# EasyEDA Pro project jlcProject.epro, schematic Schematic6
Create Date: 2025-04-17; Page Name: P1; Project Name: 电综; Schematic Name: Schematic6; Update Date: 2025-04-17; Company: 嘉立创EDA; Page Size: A4; Version: V1.0
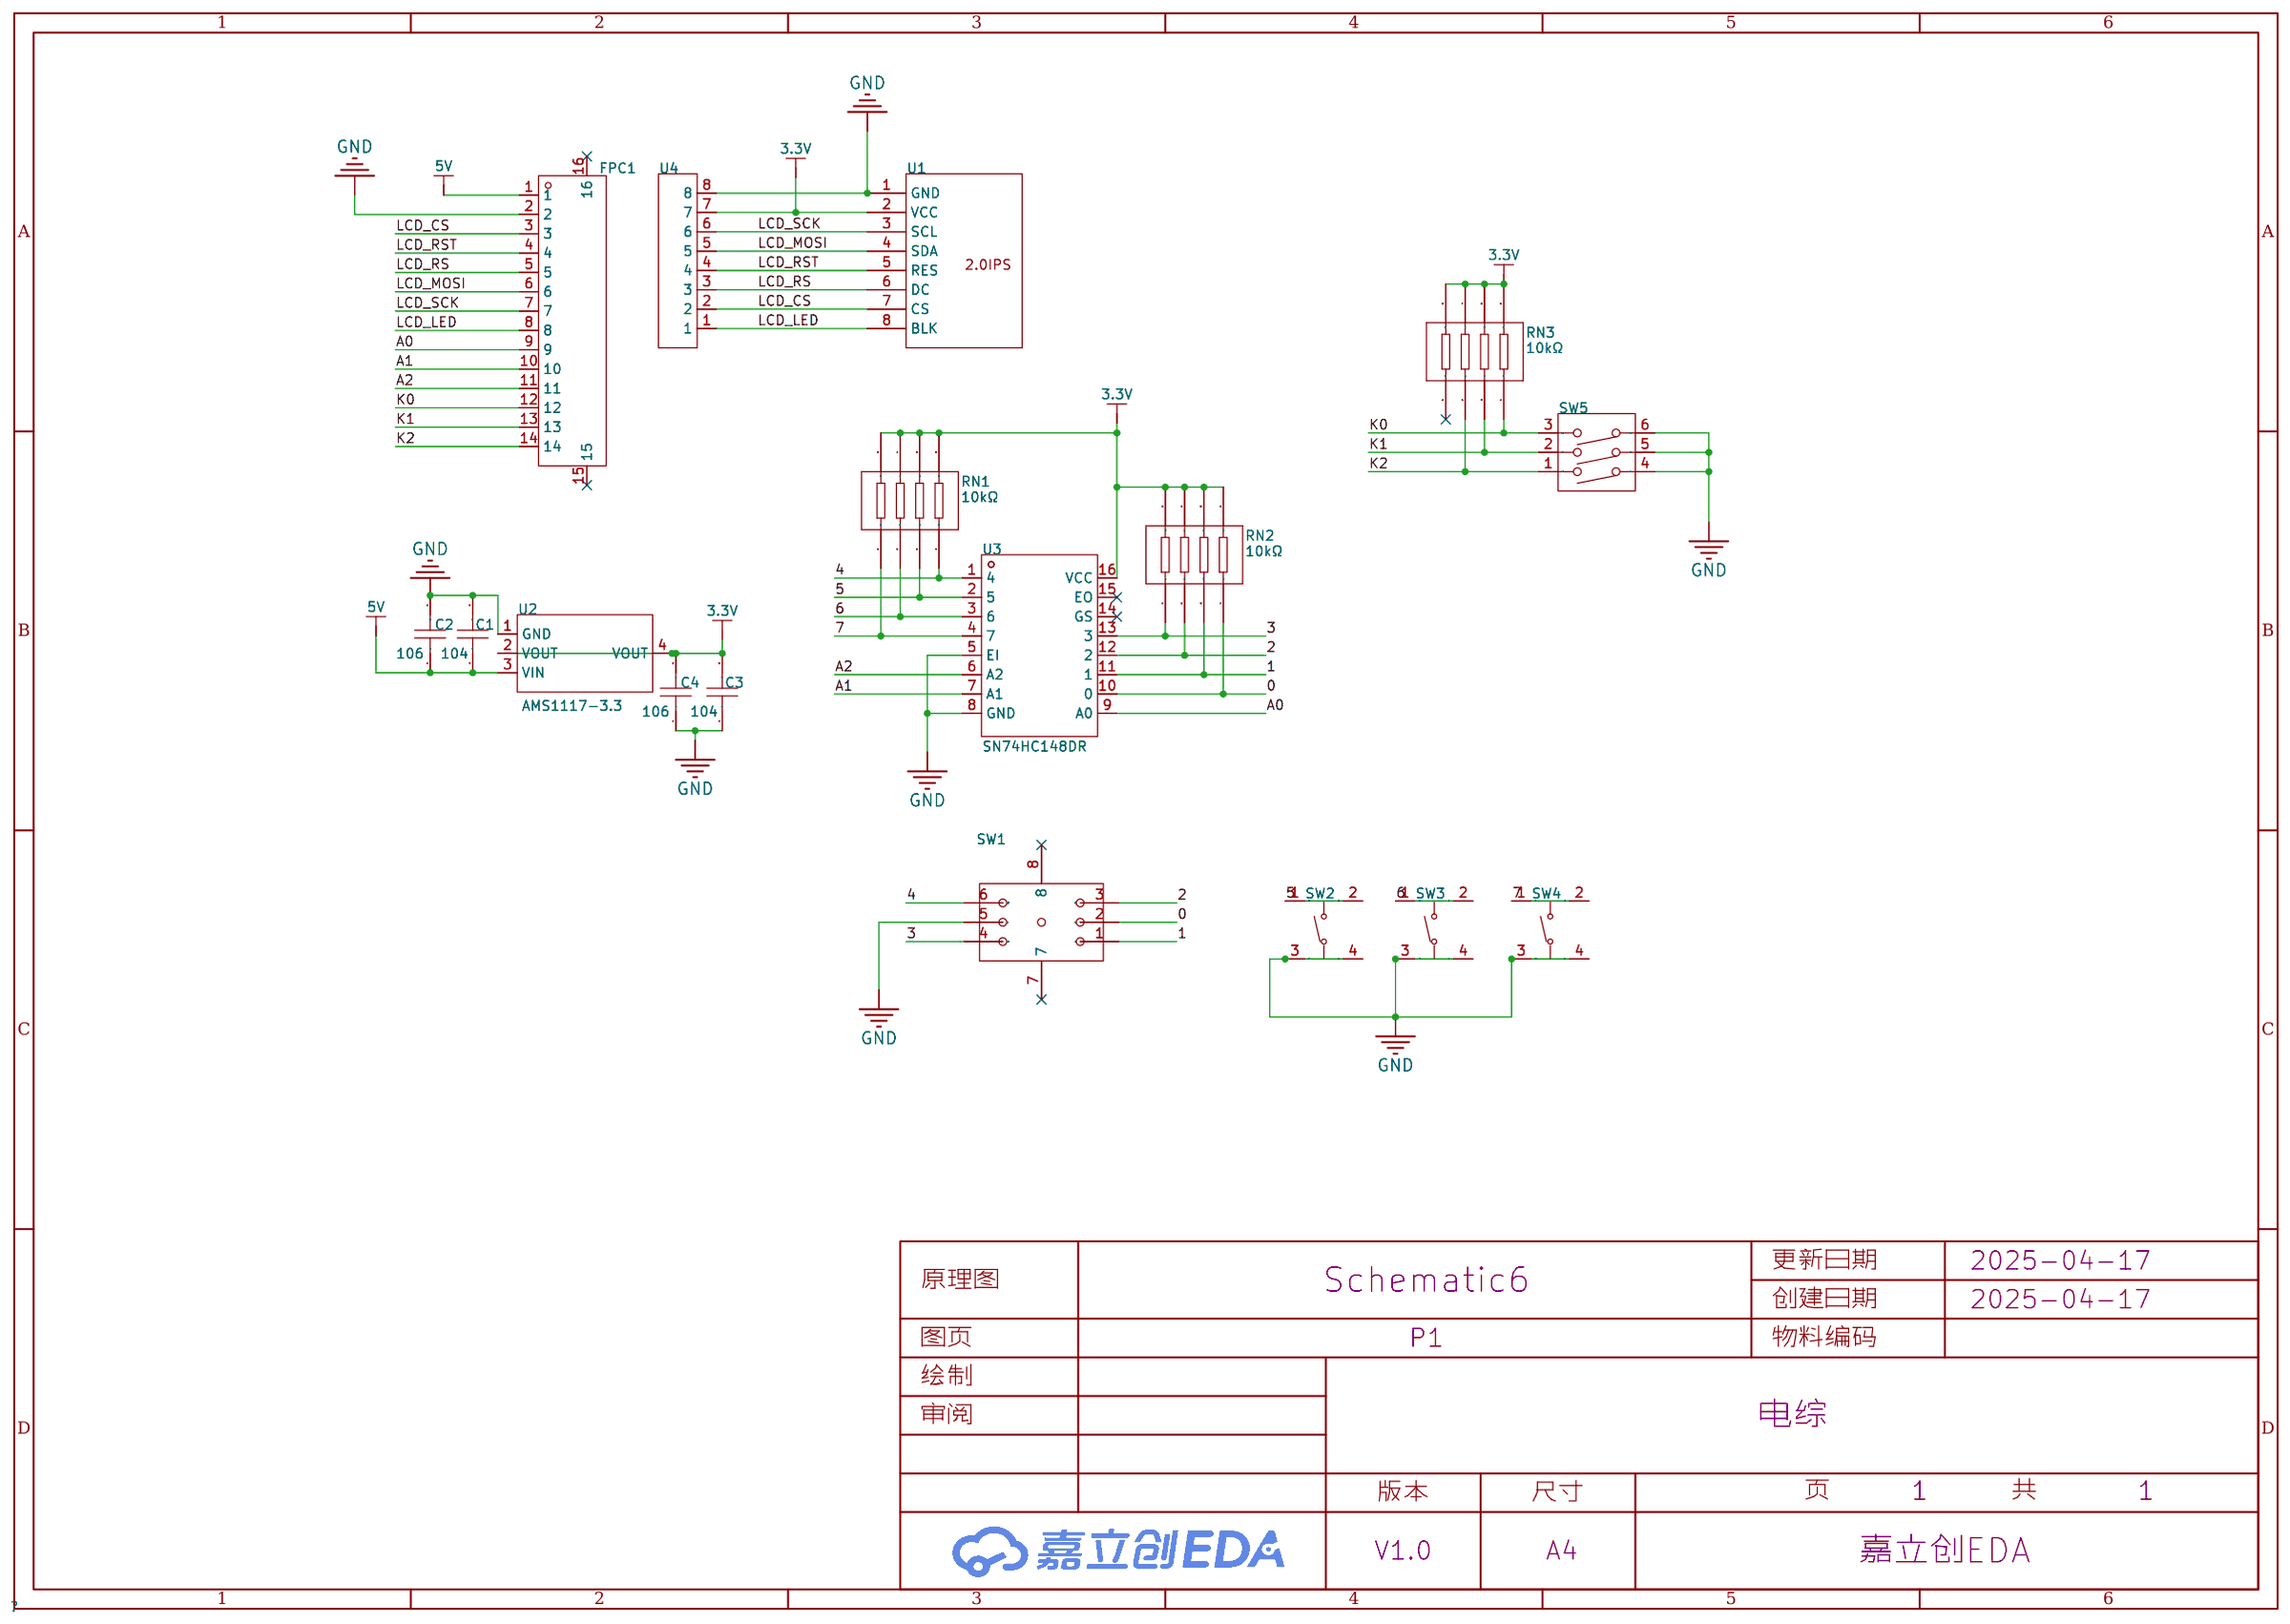
[diagram p3: schematic sheet]

## Parts
C1  104  [C0805]
C2  106  [C0805]
C3  104  [C0805]
C4  106  [C0805]
FPC1  FPC-05F-14PH15  [FPC-SMD_14P-P0.50_XUNPU_FPC-05F-14PH15]
RN1  10kΩ  [RES-ARRAY-SMD_0603-8P-L3.2-W1.6-BL]
RN2  10kΩ  [RES-ARRAY-SMD_0603-8P-L3.2-W1.6-BL]
RN3  10kΩ  [RES-ARRAY-SMD_0603-8P-L3.2-W1.6-BL]
SW1  K1-5203UA-02  [SW-TH_K1-5203UA-02]
SW2  TS-1089S-02526  [SW-SMD_4P-L4.2-W3.3-P2.15-LS5.1]
SW3  TS-1089S-02526  [SW-SMD_4P-L4.2-W3.3-P2.15-LS5.1]
SW4  TS-1089S-02526  [SW-SMD_4P-L4.2-W3.3-P2.15-LS5.1]
SW5  DSWB03LHGET  [SW-TH_DSWB03LHGET]
U1  -  [2.0IPS屏]
U2  AMS1117-3.3  [SOT-223-3_L6.5-W3.4-P2.30-LS7.0-BR]
U3  SN74HC148DR  [SOIC-16_L9.9-W3.9-P1.27-LS6.0-BL]
U4  HC-PM254-8.5H-1x8PW  [HDR-TH_HC-PM254-8.5H-1X8PW]

## Library data of the parts
C1-C4 = CAP_0805: Supplier Footprint: 0805
FPC1 = FPC-05F-14PH15: 锁定特性:翻盖式;触点类型:下接;触点数量:14P;间距:0.5mm;安装类型:卧贴;工作温度范围:-25℃~+85℃;; LCSC Part Name: 间距:0.5mm P数:14P 翻盖式 下接; Supplier Part: C2856818; Manufacturer: XUNPU(讯普); Supplier Footprint: SMD,P=0.5mm,卧贴; JLCPCB Part Class: 扩展库; Datasheet: https://atta.szlcsc.com/upload/public/pdf/source/20210922/C2856818_BF9A09706769A6AB1B749235C5052B10.pdf; Supplier: LCSC; Locking Feature: 翻盖式; Contact Type: 下接; Number of Contacts: 14P; Pitch: 0.5mm; Mounting Type: 卧贴; FFC, FCB Thickness: 0.3mm; Height Above Board: 1.5mm; Operating Temperature Range: -25℃~+85℃
RN1-RN3 = 4D03WGJ0103T5E: 电阻器数:4;阻值:10kΩ;精度:±5%;单个元件功率:62.5mW;温度系数:±200ppm/℃;; LCSC Part Name: 10kΩ ±5%; Supplier Part: C29718; Manufacturer: UNI-ROYAL(厚声); Supplier Footprint: 0603x4; JLCPCB Part Class: 基础库; Datasheet: https://atta.szlcsc.com/upload/public/pdf/source/20191224/C474318_2527498AE30E813171187CCD28401A71.pdf; Supplier: LCSC; Number of Resistors: 4; Tolerance: ±5%; Power(Watts): 62.5mW; Temperature Coefficient: ±200ppm/℃; Number of Pins: 8
SW1 = K1-5203UA-02: Supplier Part: C145898; Manufacturer: 韩国韩荣; Supplier Footprint: SMD,7.5x7.5mm; JLCPCB Part Class: 扩展库; Datasheet: https://atta.szlcsc.com/upload/public/pdf/source/20171123/C145898_15114111438911137926.pdf; Supplier: LCSC
SW2-SW4 = TS-1089S-02526: 电路结构:单刀单掷;按钮形状:椭圆形按钮;安装方式:立贴;开关长度:4.2mm;开关宽度:3.25mm;开关高度:2.5mm;触点电流:50mA;额定电压(DC):12V;带灯:-;机械寿命:-;; LCSC Part Name: 4.2*3.25*2.5mm 立贴 轻触开关; Supplier Part: C455282; Manufacturer: XUNPU(讯普); Supplier Footprint: SMD,3.3x4.2mm; JLCPCB Part Class: 扩展库; Datasheet: https://atta.szlcsc.com/upload/public/pdf/source/20191118/C455282_2E86A26A9CC4FEF4662951C4D45ED672.pdf; Supplier: LCSC; Circuit: 单刀单掷; Actuator Style: 椭圆形按钮; Mounting Style: 立贴; Switch Length: 4.2mm; Switch Width: 3.25mm; Switch Height: 2.5mm; Contact Current: 50mA; Voltage Rating (DC): 12V
SW5 = DSWB03LHGET: 类型:平拨,凸起式;电路结构:单刀单掷;开关位数:3位;使用寿命:-;颜色:红色;; LCSC Part Name: 间距2.54mm 平拨,凸起式 3位拨码开关; Supplier Part: C99420; Manufacturer: YE; Supplier Footprint: 插件; JLCPCB Part Class: Extended Part; Datasheet: https://atta.szlcsc.com/upload/public/pdf/source/20170330/1490854274194.pdf; Supplier: LCSC; Type: 平拨,凸起式; Circuit: 单刀单掷; Number of Positions: 3位; Lead Pitch: 2.54mm; Color: 红色
U1 = 2.0IPS屏
U2 = AMS1117-3.3_C6186: 输出类型:固定;工作电压:-;输出电压:3.3V;输出电流:1A;电源纹波抑制比(PSRR):72dB@(120Hz);输出极性:正极;; LCSC Part Name: 输出3.3V 1A; Supplier Part: C6186; Manufacturer: AMS; Supplier Footprint: SOT-223; JLCPCB Part Class: Basic Part; Datasheet: https://atta.szlcsc.com/upload/public/pdf/source/20180727/C6186_7A095716F0823C02F1997A905E26C086.pdf; Supplier: LCSC; Output Type: 固定; Output Voltage: 3.3V; Output Current: 1A; Power Supply Rejection Ratio (PSRR): 72dB@(120Hz); Voltage Dropout: 1.3V@(800mA); Features: 过流保护(OCP)；热关断(TSD); Output Configuration: 正极; Number of Outputs: 1
U3 = SN74HC148DR: 供电电压:2V~6V;灌电流(IOL):5.2mA;拉电流(IOH):5.2mA;; Supplier Part: C6819; Manufacturer: TI(德州仪器); Supplier Footprint: SOIC-16; JLCPCB Part Class: 扩展库; Datasheet: https://www.ti.com/cn/lit/gpn/sn74hc148; Supplier: LCSC; Type: 优先顺序编码器; Voltage Supply Source: 单电源; Supply Voltage: 2V~6V; Sink Current: 5.2mA; Source Current: 5.2mA; Operating temperature: -40℃~+85℃
U4 = HC-PM254-8.5H-1x8PW: 插孔结构:1x8P;间距:2.54mm;行距:-;圆孔/方孔:方孔;安装方式:弯插;排数:单排;总孔位数:8P;额定电流:3A;额定电压:-;插孔方向:侧面;塑高:2.5mm;触头材质:黄铜;触头镀层:金;工作温度:-40℃~+105℃;; LCSC Part Name: 间距2.54mm 1x8Pin 弯插 PC3.2 PB10.2 H8.5; Supplier Part: C22436149; Manufacturer: HC(虹成电子); Supplier Footprint: 弯插,P=2.54mm; JLCPCB Part Class: 扩展库; Datasheet: https://atta.szlcsc.com/upload/public/pdf/source/20250106/7DEA8FB232A3A4CE59A29021EA4A6B95.pdf; Supplier: LCSC; Holes Structure: 1x8P; Pitch: 2.54mm; Circular Hole / Square Hole: 方孔; Mounting Type: 弯插; Number of Rows: 单排; Number of Positions: 8P; Current Rating: 3A; Holes Direction: 侧面; Insulation Height: 2.5mm; Contact Material: 黄铜; Contact Plating: 金; Operating Temperature: -40℃~+105℃; PIN Length: 3mm

## Nets
3.3V: C3.2 C4.2 RN1.5 RN1.6 RN1.7 RN1.8 RN2.5 RN2.6 RN2.7 RN2.8 RN3.5 RN3.6 RN3.7 RN3.8 U1.2(VCC) U2.2(VOUT) U2.4(VOUT) U3.16(VCC) U4.7
5V: C1.1 C2.1 FPC1.1 U2.3(VIN)
GND: C1.2 C2.2 C3.1 C4.1 FPC1.2 SW1.5(D) SW2.3 SW2.4 SW3.3 SW3.4 SW4.3 SW4.4 SW5.4 SW5.5 SW5.6 U1.1(GND) U2.1(GND) U3.5(EI) U3.8(GND) U4.8
0: RN2.4 SW1.2(B) U3.10(0)
1: RN2.3 SW1.1(A) U3.11(1)
2: RN2.2 SW1.3(C) U3.12(2)
3: RN2.1 SW1.4(CENTER) U3.13(3)
4: RN1.4 SW1.6(COMMON) U3.1(4)
5: RN1.3 SW2.1 SW2.2 U3.2(5)
6: RN1.2 SW3.1 SW3.2 U3.3(6)
7: RN1.1 SW4.1 SW4.2 U3.4(7)
A0: FPC1.9 U3.9(A0)
A1: FPC1.10 U3.7(A1)
A2: FPC1.11 U3.6(A2)
K0: FPC1.12 RN3.4 SW5.3
K1: FPC1.13 RN3.3 SW5.2
K2: FPC1.14 RN3.2 SW5.1
LCD_CS: FPC1.3 U1.7(CS) U4.2
LCD_LED: FPC1.8 U1.8(BLK) U4.1
LCD_MOSI: FPC1.6 U1.4(SDA) U4.5
LCD_RS: FPC1.5 U1.6(DC) U4.3
LCD_RST: FPC1.4 U1.5(RES) U4.4
LCD_SCK: FPC1.7 U1.3(SCL) U4.6

Not connected (* = marked no-connect by the designer): FPC1 15* 16*; RN3 1*; SW1 7* 8*; U3 14(GS)* 15(EO)*
